# Altium schematic sheet COVER PAGE.SchDoc
size A3; SheetNumber: 2; SheetTotal: 5
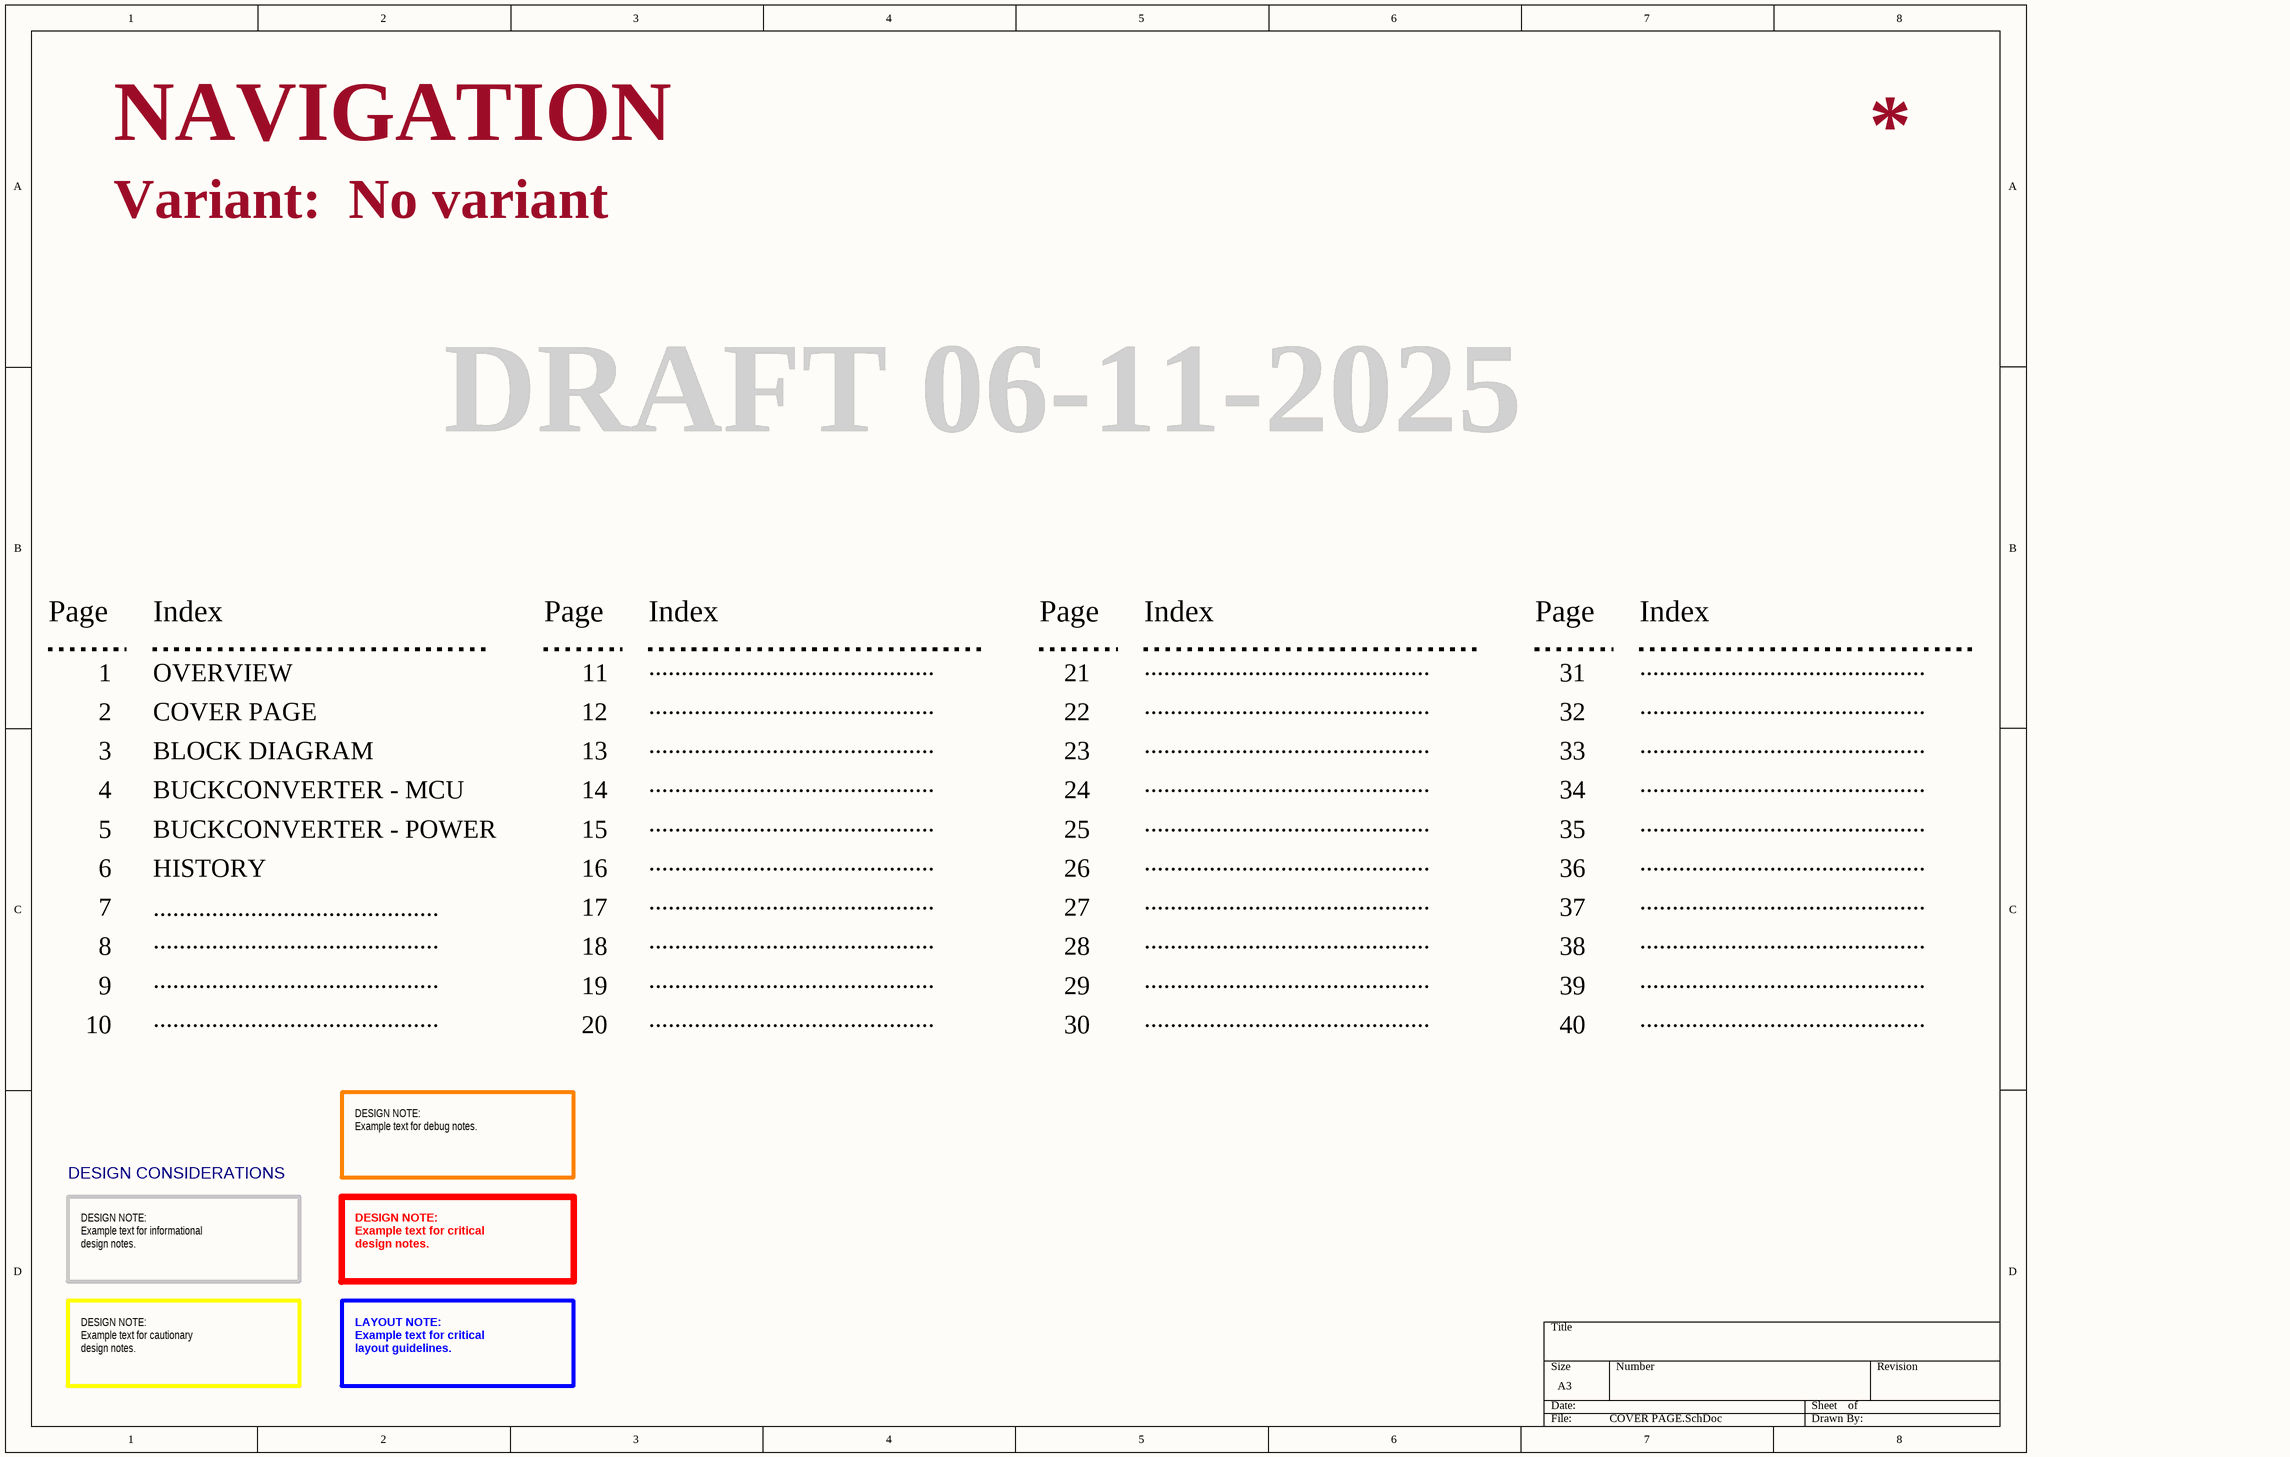
[diagram p0: COVER PAGE.SchDoc]

## Notes on the sheet
- NAVIGATION
- Variant:
- No variant
- DRAFT 06-11-2025
- Page
- Index
- 1
- OVERVIEW
- 11
- ............................................
- 21
- 31
- 2
- 3
- COVER PAGE
- BLOCK DIAGRAM
- 12
- 13
- 22
- 23
- 32
- 33
- 4
- BUCKCONVERTER - MCU
- 14
- 24
- 34
- 5
- 6
- BUCKCONVERTER - POWER
- HISTORY
- 15
- 16
- 25
- 26
- 35
- 36
- 7
- 8
- 17
- 18
- 27
- 28
- 37
- 38
- 9
- 19
- 29
- 39
- 10
- 20
- 30
- 40
- DESIGN CONSIDERATIONS
- DESIGN NOTE:
  Example text for debug notes.
- DESIGN NOTE:
  Example text for informational
  design notes.
- DESIGN NOTE:
  Example text for critical
  design notes.
- DESIGN NOTE:
  Example text for cautionary
  design notes.
- LAYOUT NOTE:
  Example text for critical
  layout guidelines.